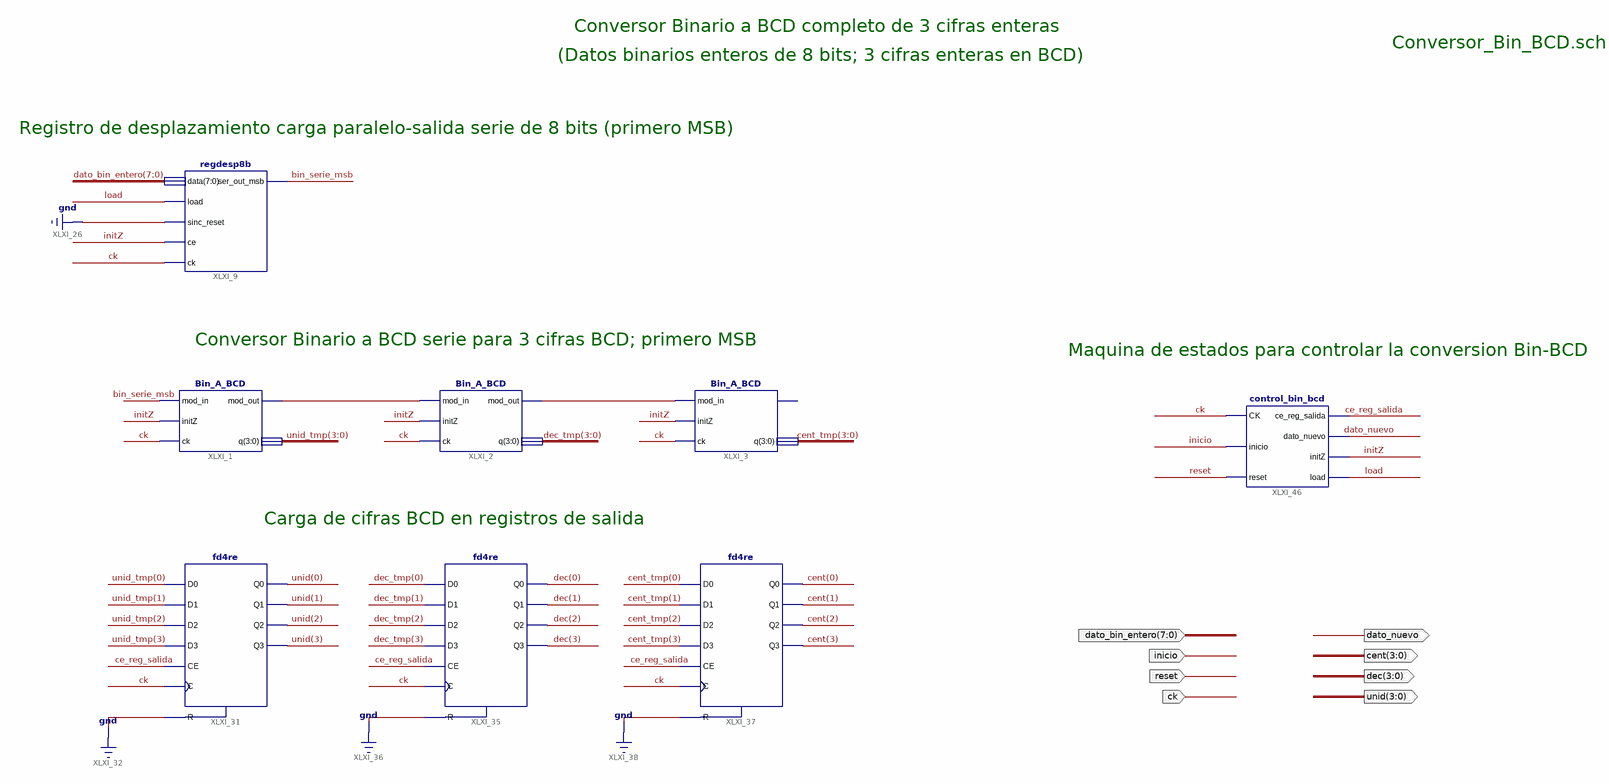
[diagram p0: schematic sheet 1]
// Xilinx ISE schematic Conversor_Bin_BCD_3cifras.sch (spartan6) as structural Verilog: 8 symbols, 8 ports
module Conversor_Bin_BCD_3cifras (
  input  ck,
  input  [7:0] dato_bin_entero,
  input  inicio,
  input  reset,
  output dato_nuevo,
  output [3:0] unid,
  output [3:0] dec,
  output [3:0] cent
);

  wire bin_serie_msb, ce_reg_salida, initZ, load, XLXN_8, XLXN_9;
  wire [3:0] cent_tmp, dec_tmp, unid_tmp;

  regdesp8b XLXI_9 (
    .ck(ck), .ce(initZ), .sinc_reset(1'b0), .load(load), .data(dato_bin_entero), .ser_out_msb(bin_serie_msb));
  Bin_A_BCD XLXI_2 (.initZ(initZ), .ck(ck), .mod_in(XLXN_9), .mod_out(XLXN_8), .q(dec_tmp));
  Bin_A_BCD XLXI_1 (.initZ(initZ), .ck(ck), .mod_in(bin_serie_msb), .mod_out(XLXN_9), .q(unid_tmp));
  Bin_A_BCD XLXI_3 (.initZ(initZ), .ck(ck), .mod_in(XLXN_8), .q(cent_tmp));  // open: mod_out
  fd4re XLXI_35 (
    .C(ck), .CE(ce_reg_salida), .D0(dec_tmp[0]), .D1(dec_tmp[1]), .D2(dec_tmp[2]), .D3(dec_tmp[3]), .R(1'b0),
    .Q0(dec[0]), .Q1(dec[1]), .Q2(dec[2]), .Q3(dec[3]));
  fd4re XLXI_37 (
    .C(ck), .CE(ce_reg_salida), .D0(cent_tmp[0]), .D1(cent_tmp[1]), .D2(cent_tmp[2]), .D3(cent_tmp[3]),
    .R(1'b0), .Q0(cent[0]), .Q1(cent[1]), .Q2(cent[2]), .Q3(cent[3]));
  fd4re XLXI_31 (
    .C(ck), .CE(ce_reg_salida), .D0(unid_tmp[0]), .D1(unid_tmp[1]), .D2(unid_tmp[2]), .D3(unid_tmp[3]),
    .R(1'b0), .Q0(unid[0]), .Q1(unid[1]), .Q2(unid[2]), .Q3(unid[3]));
  control_bin_bcd XLXI_46 (
    .CK(ck), .inicio(inicio), .reset(reset), .ce_reg_salida(ce_reg_salida), .dato_nuevo(dato_nuevo),
    .initZ(initZ), .load(load));

  // Notes on the sheet:
  //   Conversor Binario a BCD completo de 3 cifras enteras
  //   Conversor_Bin_BCD.sch
  //   (Datos binarios enteros de 8 bits; 3 cifras enteras en BCD)
  //   Registro de desplazamiento carga paralelo-salida serie de 8 bits (primero MSB)
  //   Conversor Binario a BCD serie para 3 cifras BCD; primero MSB
  //   Maquina de estados para controlar la conversion Bin-BCD
  //   Carga de cifras BCD en registros de salida
endmodule
